# Altium schematic sheet mainboard.SchDoc
size A4
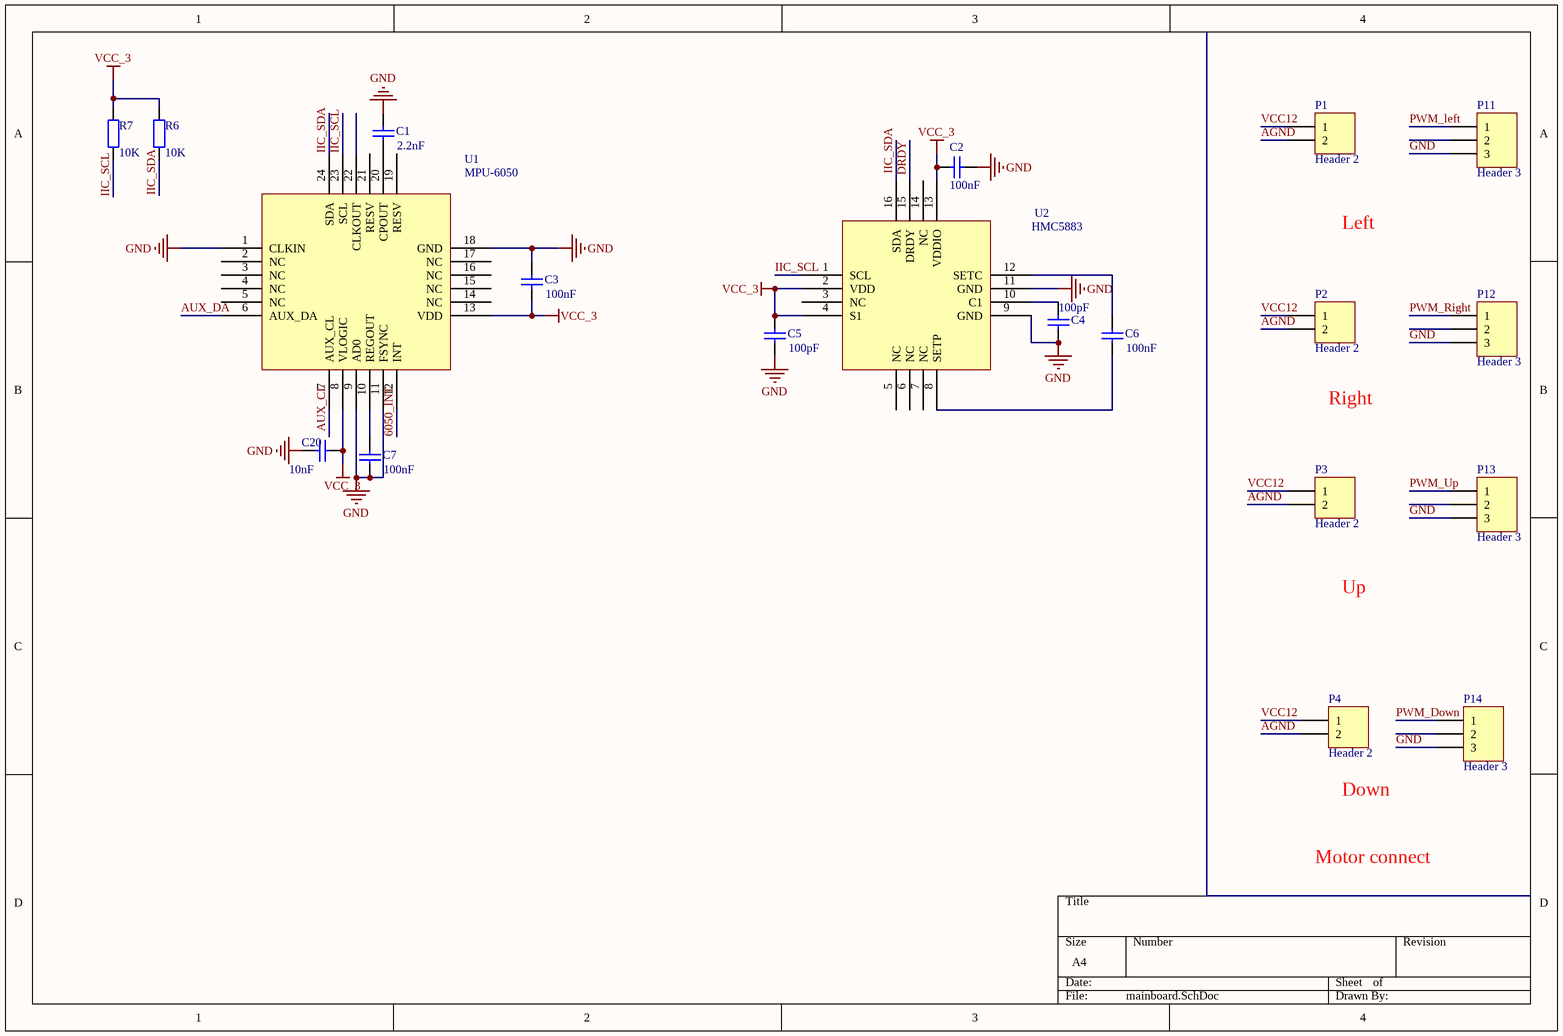
[diagram p0: mainboard.SchDoc]

## Parts
C1  value 2.2nF  [0603]  (hidden comment: Cap)
C2  value 100nF  [0603]  (hidden comment: Cap)
C3  value 100nF  [0603]  (hidden comment: Cap)
C4  value 100pF  [0603]  (hidden comment: Cap)
C5  value 100pF  [0603]  (hidden comment: Cap)
C6  value 100nF  [0603]  (hidden comment: Cap)
C7  value 100nF  [0603]  (hidden comment: Cap)
C20  value 10nF  [0603]  (hidden comment: Cap)
P1  Header 2  [motor connect]
P2  Header 2  [motor connect]
P3  Header 2  [motor connect]
P4  Header 2  [motor connect]
P11  Header 3  [HDR1X3]
P12  Header 3  [HDR1X3]
P13  Header 3  [HDR1X3]
P14  Header 3  [HDR1X3]
R6  value 10K  [0603]  (hidden comment: Res2)
R7  value 10K  [0603]  (hidden comment: Res2)
U1  MPU-6050  [MPU-6050]
U2  HMC5883  [HMC5883L]

## Nets
GND: C1.2 C2.1 C3.2 C4.2 C5.1 C7.1 C20.2 P11.3 P12.3 P13.3 P14.3 U1.1(CLKIN) U1.9(AD0) U1.11(FSYNC) U1.18(GND) U2.9(GND) U2.11(GND)
VCC_3: C2.2 C3.1 C5.2 C20.1 R6.2 R7.2 U1.8(VLOGIC) U1.13(VDD) U2.2(VDD) U2.4(S1) U2.13(VDDIO)
6050_INT: U1.12(INT)
AGND: P1.2 P2.2 P3.2 P4.2
AUX_CL: U1.7(AUX_CL)
AUX_DA: U1.6(AUX_DA)
DRDY: U2.15(DRDY)
IIC_SCL: R7.1 U1.23(SCL) U2.1(SCL)
IIC_SDA: R6.1 U1.24(SDA) U2.16(SDA)
PWM_Down: P14.1
PWM_left: P11.1
PWM_Right: P12.1
PWM_Up: P13.1
VCC12: P1.1 P2.1 P3.1 P4.1
NetC1_1: C1.1 U1.20(CPOUT)
NetC4_1: C4.1 U2.10(C1)
NetC6_1: C6.1 U2.8(SETP)
NetC6_2: C6.2 U2.12(SETC)
NetC7_2: C7.2 U1.10(REGOUT)

Not connected (* = marked no-connect by the designer): P11 2; P12 2; P13 2; P14 2; U1 2(NC) 3(NC) 4(NC) 5(NC) 14(NC) 15(NC) 16(NC) 17(NC) 19(RESV) 21(RESV) 22(CLKOUT); U2 3(NC) 5(NC) 6(NC) 7(NC) 14(NC)

## Notes on the sheet
- Left
- Right
- Up
- (near P4) Down
- Motor connect

## Library data of the parts
C1-C7 C20 = Cap: Capacitor; Published: 8-Jun-2000; LatestRevisionDate: 17-Jul-2002; LatestRevisionNote: Re-released for DXP Platform.; PackageReference: RAD-0.3; Publisher: Altium Limited
P1-P4 = Header 2: Header, 2-Pin; LatestRevisionDate: 17-Jul-2002; LatestRevisionNote: Re-released for DXP Platform.; Publisher: Altium Limited
P11-P14 = Header 3: Header, 3-Pin; LatestRevisionDate: 17-Jul-2002; LatestRevisionNote: Re-released for DXP Platform.; Publisher: Altium Limited
R6 R7 = Res2: Resistor; Published: 8-Jun-2000; LatestRevisionDate: 17-Jul-2002; LatestRevisionNote: Re-released for DXP Platform.; PackageReference: AXIAL-0.4; Publisher: Altium Limited